# EasyEDA schematic Easy-EDA-project.json
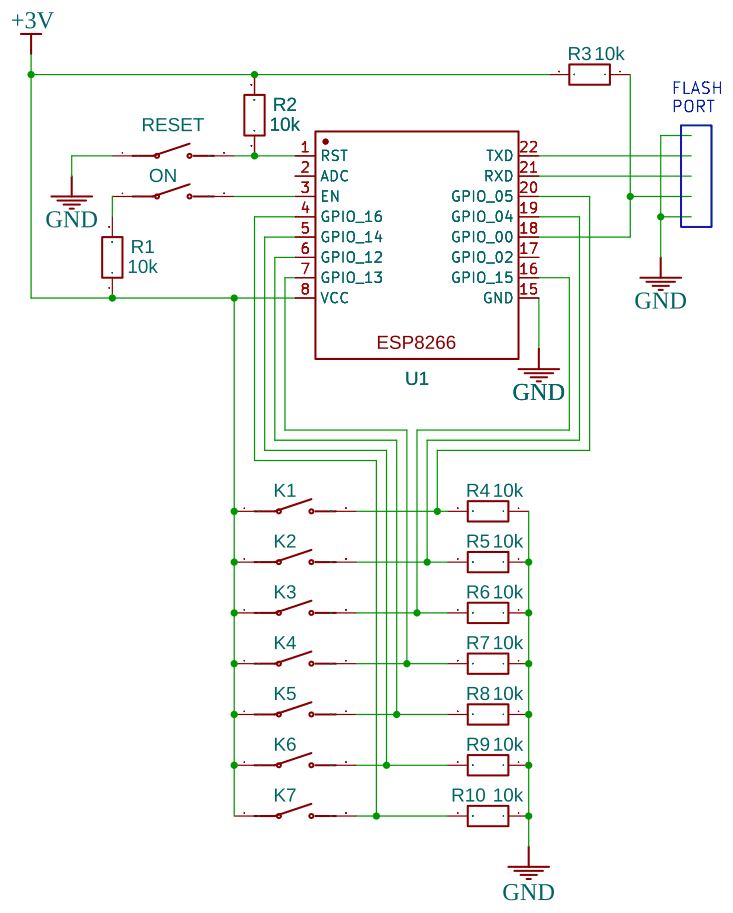
[diagram p0: schematic sheet]

## Parts
K1  SWITCH,3*6*5PLASTIC HEAD WHITE,260G, 0.25MM,SMD  [SW-TH_L6.2-W3.6-LS8.0]
K2  SWITCH,3*6*5PLASTIC HEAD WHITE,260G, 0.25MM,SMD  [SW-TH_L6.2-W3.6-LS8.0]
K3  SWITCH,3*6*5PLASTIC HEAD WHITE,260G, 0.25MM,SMD  [SW-TH_L6.2-W3.6-LS8.0]
K4  SWITCH,3*6*5PLASTIC HEAD WHITE,260G, 0.25MM,SMD  [SW-TH_L6.2-W3.6-LS8.0]
K5  SWITCH,3*6*5PLASTIC HEAD WHITE,260G, 0.25MM,SMD  [SW-TH_L6.2-W3.6-LS8.0]
K6  SWITCH,3*6*5PLASTIC HEAD WHITE,260G, 0.25MM,SMD  [SW-TH_L6.2-W3.6-LS8.0]
K7  SWITCH,3*6*5PLASTIC HEAD WHITE,260G, 0.25MM,SMD  [SW-TH_L6.2-W3.6-LS8.0]
ON  SWITCH,3*6*5PLASTIC HEAD WHITE,260G, 0.25MM,SMD  [SW-TH_L6.2-W3.6-LS8.0]
R1  10k  [AXIAL-0.3]
R2  10k  [AXIAL-0.3]
R3  10k  [AXIAL-0.3]
R4  10k  [AXIAL-0.3]
R5  10k  [AXIAL-0.3]
R6  10k  [AXIAL-0.3]
R7  10k  [AXIAL-0.3]
R8  10k  [AXIAL-0.3]
R9  10k  [AXIAL-0.3]
R10  10k  [AXIAL-0.3]
RESET  SWITCH,3*6*5PLASTIC HEAD WHITE,260G, 0.25MM,SMD  [SW-TH_L6.2-W3.6-LS8.0]
U1  esp8266-12  [ESP8266-12]

## Library data of the parts
K1-K7 ON RESET = SWITCH,3*6*5PLASTIC HEAD WHITE,260G, 0.25MM,SMD: Supplier: LCSC; Manufacturer: BBJ; Manufacturer Part: Switch,3*6*5Plastic head white,260G, 0.25mm,SMD; Contributor: LCSC; Supplier Part: C71855
R1-R10 = Res_AXIAL-0.3(1/8W)_EU: Manufacturer Part: ?
U1 = -: Manufacturer Part: New SchematicLib; Contributor: dnk1777

## Nets
+3V: K1.1 K2.1 K3.1 K4.1 K5.1 K6.1 K7.1 R1.1 R2.2 R3.2 U1.8(VCC)
GND: R4.1 R5.1 R6.1 R7.1 R8.1 R9.1 R10.1 RESET.1 U1.15(GND)
Net-(K1-2): K1.2 R4.2 U1.20(GPIO 05)
Net-(K2-2): K2.2 R5.2 U1.19(GPIO 04)
Net-(K3-2): K3.2 R6.2 U1.16(GPIO 15)
Net-(K4-2): K4.2 R7.2 U1.7(GPIO 13)
Net-(K5-2): K5.2 R8.2 U1.6(GPIO 12)
Net-(K6-2): K6.2 R9.2 U1.5(GPIO 14)
Net-(K7-2): K7.2 R10.2 U1.4(GPIO 16)
Net-(ON-1): ON.1 R1.2
Net-(ON-2): ON.2 U1.3(EN)
Net-(R2-1): R2.1 RESET.2 U1.1(RST)
Net-(R3-1): R3.1 U1.18(GPIO 00)

Not connected (* = marked no-connect by the designer): U1 2(ADC) 17(GPIO 02) 21(RXD) 22(TXD)

## Notes on the sheet
- FLASH
  PORT
